# Altium project PowerBoard.PrjPcb
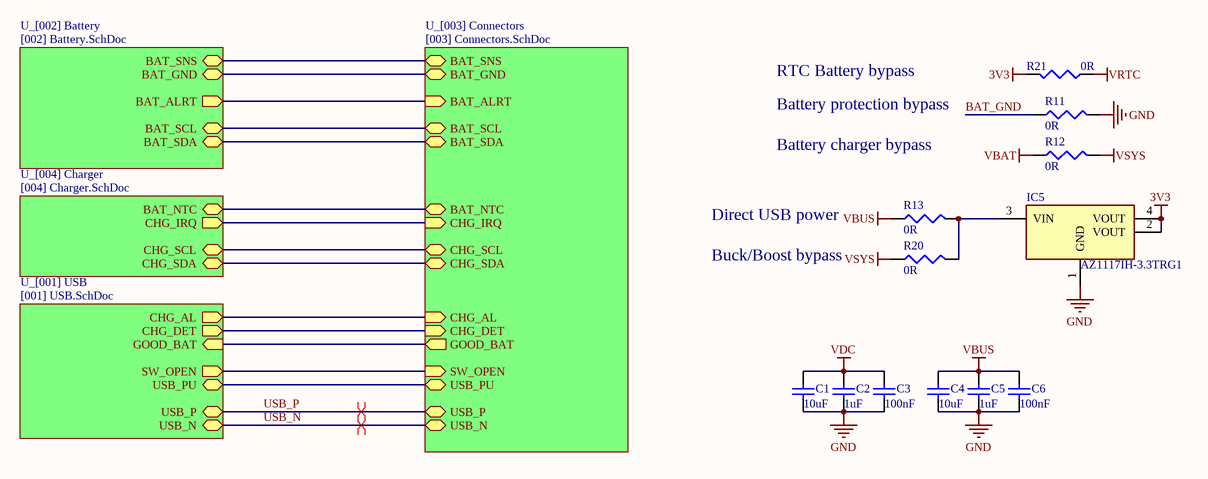
[diagram p0: [000] Block Diagram.SchDoc]
5 sheets, 84 parts. Net scope: global (net labels, ports and power ports of the same name join across sheets).
Board files: PowerBoard.PcbDoc, PowerBoardv2.PcbDoc
Sheets:
  [000] Block Diagram.SchDoc
    U_[004] Charger = [004] Charger.SchDoc
    U_[001] USB = [001] USB.SchDoc
    U_[002] Battery = [002] Battery.SchDoc
    U_[003] Connectors = [003] Connectors.SchDoc

## Sheet [000] Block Diagram.SchDoc
size A4

### Parts
C1  value 10uF  [1608[0603]]  (hidden comment: Cap Semi)
C2  value 1uF  [1608[0603]]  (hidden comment: Cap Semi)
C3  value 100nF  [1608[0603]]  (hidden comment: Cap Semi)
C4  value 10uF  [1608[0603]]  (hidden comment: Cap Semi)
C5  value 1uF  [1608[0603]]  (hidden comment: Cap Semi)
C6  value 100nF  [1608[0603]]  (hidden comment: Cap Semi)
IC5  AZ1117IH-3.3TRG1  [SOT230P700X170-4N]
R11  value 0R  [J1-0603]  (hidden comment: Res3)
R12  value 0R  [J1-0603]  (hidden comment: Res3)
R13  value 0R  [J1-0603]  (hidden comment: Res3)
R20  value 0R  [J1-0603]  (hidden comment: Res3)
R21  value 0R  [J1-0603]  (hidden comment: Res3)

### Sub-sheets
U_[001] USB = [001] USB.SchDoc: USB_N (bidir), USB_P (bidir), USB_PU (bidir), GOOD_BAT (in), SW_OPEN (out), CHG_AL (out), CHG_DET (out)
U_[002] Battery = [002] Battery.SchDoc: BAT_ALRT (out), BAT_SDA (bidir), BAT_SCL (bidir), BAT_GND (bidir), BAT_SNS (bidir)
U_[003] Connectors = [003] Connectors.SchDoc: BAT_SNS (bidir), BAT_GND (bidir), BAT_NTC (bidir), CHG_IRQ (in), BAT_ALRT (in), CHG_SCL (bidir), CHG_SDA (bidir), BAT_SCL (bidir), BAT_SDA (bidir), CHG_AL (in), CHG_DET (in), GOOD_BAT (out), SW_OPEN (in), USB_PU (bidir), USB_P (bidir), USB_N (bidir)
U_[004] Charger = [004] Charger.SchDoc: CHG_IRQ (out), CHG_SDA (bidir), CHG_SCL (bidir), BAT_NTC (bidir)

### Nets
3V3: IC5.2(VOUT) IC5.4(VOUT) R21.2
GND: C1.1 C2.1 C3.1 C4.1 C5.1 C6.1 IC5.1(GND) R11.2
VBAT: R12.1
VBUS: C4.2 C5.2 C6.2 R13.1
VDC: C1.2 C2.2 C3.2
VRTC: R21.1
VSYS: R12.2 R20.1
BAT_GND: R11.1
USB_N: sheet U_[001] USB/USB_N, sheet U_[003] Connectors/USB_N
USB_P: sheet U_[001] USB/USB_P, sheet U_[003] Connectors/USB_P
NetIC5_3: IC5.3(VIN) R13.2 R20.2
(unnamed): sheet U_[004] Charger/CHG_IRQ, sheet U_[003] Connectors/CHG_IRQ
(unnamed): sheet U_[004] Charger/CHG_SDA, sheet U_[003] Connectors/CHG_SDA
(unnamed): sheet U_[004] Charger/CHG_SCL, sheet U_[003] Connectors/CHG_SCL
(unnamed): sheet U_[004] Charger/BAT_NTC, sheet U_[003] Connectors/BAT_NTC
(unnamed): sheet U_[001] USB/USB_PU, sheet U_[003] Connectors/USB_PU
(unnamed): sheet U_[001] USB/GOOD_BAT, sheet U_[003] Connectors/GOOD_BAT
(unnamed): sheet U_[001] USB/SW_OPEN, sheet U_[003] Connectors/SW_OPEN
(unnamed): sheet U_[001] USB/CHG_AL, sheet U_[003] Connectors/CHG_AL
(unnamed): sheet U_[001] USB/CHG_DET, sheet U_[003] Connectors/CHG_DET
(unnamed): sheet U_[002] Battery/BAT_ALRT, sheet U_[003] Connectors/BAT_ALRT
(unnamed): sheet U_[002] Battery/BAT_SDA, sheet U_[003] Connectors/BAT_SDA
(unnamed): sheet U_[002] Battery/BAT_SCL, sheet U_[003] Connectors/BAT_SCL
(unnamed): sheet U_[002] Battery/BAT_GND, sheet U_[003] Connectors/BAT_GND
(unnamed): sheet U_[002] Battery/BAT_SNS, sheet U_[003] Connectors/BAT_SNS

### Layout directives
differential pair: USB_N, USB_P

### Notes on the sheet
- RTC Battery bypass
- Battery protection bypass
- Battery charger bypass
- Direct USB power
- Buck/Boost bypass

### Library data of the parts
C1-C6 = Cap Semi: Capacitor (Semiconductor SIM Model); Published: 8-Jun-2000; LatestRevisionDate: 29-May-2009; LatestRevisionNote: IPC-7351 Footprint Added.; PackageReference: C1206; Publisher: Altium Limited; PackageDescription: Chip Capacitor
IC5 = AZ1117IH-3.3TRG1: Integrated Circuit; Manufacturer_Name: Diodes Inc.; Datasheet Link: https://componentsearchengine.com/Datasheets/1/AZ1117IH-3.3TRG1.pdf; Height: 1.7mm; Mouser2 Part Number: 621-AZ1117IH-3.3TRG1; Mouser2 Price/Stock: https://www.mouser.com/Search/Refine.aspx?Keyword=621-AZ1117IH-3.3TRG1; Manufacturer_Part_Number: AZ1117IH-3.3TRG1
R11-R13 R20 R21 = Res3: Resistor; Published: 8-Jun-2000; LatestRevisionDate: 29-May-2009; LatestRevisionNote: IPC-7351 Footprint Added.; PackageReference: J1-0603; Publisher: Altium Limited; PackageDescription: Chip Resistor

## Sheet [004] Charger.SchDoc
size A4
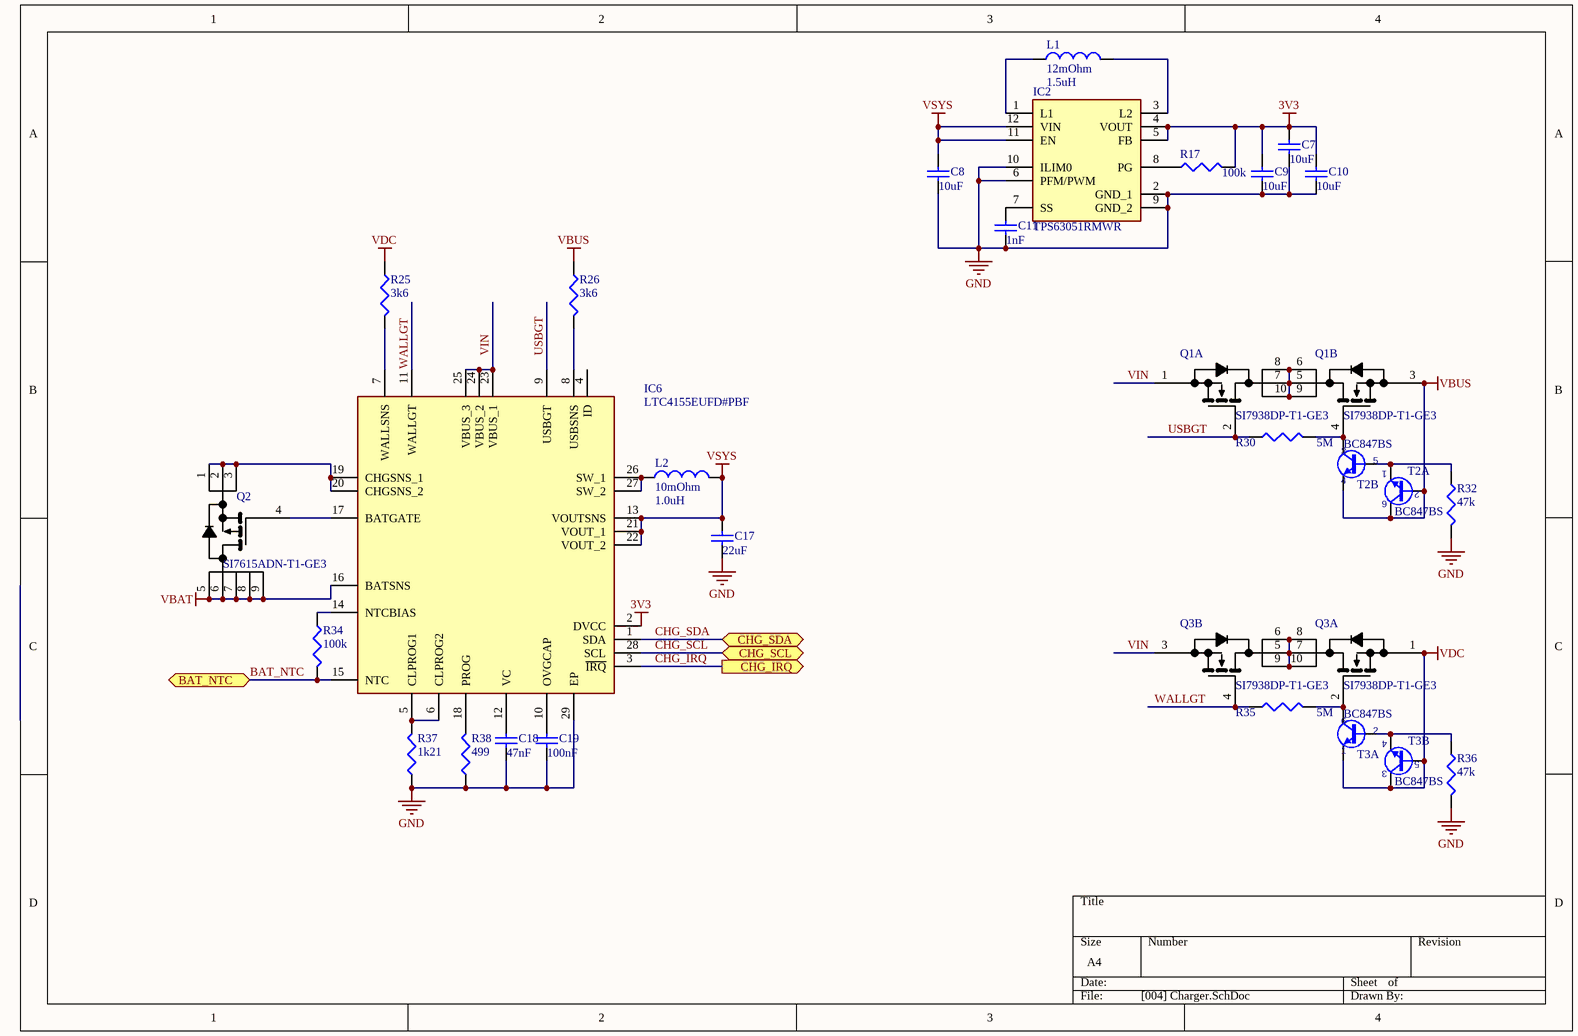
[diagram p1: [004] Charger.SchDoc]

### Parts
C7  value 10uF  [1608[0603]]  (hidden comment: Cap Semi)
C8  value 10uF  [1608[0603]]  (hidden comment: Cap Semi)
C9  value 10uF  [1608[0603]]  (hidden comment: Cap Semi)
C10  value 10uF  [1608[0603]]  (hidden comment: Cap Semi)
C11  value 1nF  [1608[0603]]  (hidden comment: Cap Semi)
C17  value 22uF  [1608[0603]]  (hidden comment: Cap Semi)
C18  value 47nF  [1608[0603]]  (hidden comment: Cap Semi)
C19  value 100nF  [1608[0603]]  (hidden comment: Cap Semi)
IC2  TPS63051RMWR  [QFN50P250X250X100-12N-D]
IC6  LTC4155EUFD#PBF  [QFN50P400X500X80-29N-D]
L1  12mOhm  value 1.5uH  [INDP2523X23N]
L2  10mOhm  value 1.0uH  [INDP2523X23N]
Q1  SI7938DP-T1-GE3  [POWERPAK-SO8_1]  (parts A,B of 2)
Q2  SI7615ADN-T1-GE3  [PowerPAK1212-8 Single]
Q3  SI7938DP-T1-GE3  [POWERPAK-SO8_1]  (parts A,B of 2)
R17  value 100k  [J1-0603]  (hidden comment: Res3)
R25  value 3k6  [J1-0603]  (hidden comment: Res3)
R26  value 3k6  [J1-0603]  (hidden comment: Res3)
R30  value 5M  [J1-0603]  (hidden comment: Res3)
R32  value 47k  [J1-0603]  (hidden comment: Res3)
R34  value 100k  [J1-0603]  (hidden comment: Res3)
R35  value 5M  [J1-0603]  (hidden comment: Res3)
R36  value 47k  [J1-0603]  (hidden comment: Res3)
R37  value 1k21  [J1-0603]  (hidden comment: Res3)
R38  value 499  [J1-0603]  (hidden comment: Res3)
T2  BC847BS  [SOT65P210X110-6N]  (parts A,B of 2)
T3  BC847BS  [SOT65P210X110-6N]  (parts A,B of 2)

### Ports
BAT_NTC (bidir), CHG_IRQ (out), CHG_SCL (bidir), CHG_SDA (bidir)

### Nets
3V3: C7.2 C9.2 C10.2 IC2.4(VOUT) IC2.5(FB) IC6.2(DVCC) R17.2
GND: C7.1 C8.1 C9.1 C10.1 C11.1 C17.1 C18.1 C19.1 IC2.2(GND_1) IC2.6(PFM/PWM) IC2.9(GND_2) IC2.10(ILIM0) IC6.29(EP) R32.2 R36.2 R37.1 R38.1
VBAT: IC6.16(BATSNS) Q2.5(D) Q2.6(D) Q2.7(D) Q2.8(D) Q2.9(D)
VBUS: Q1.3(S2) R26.1 T2.2(B) T2.4(E) T2.6(C)
VDC: Q3.1(S1) R25.1 T3.1(E) T3.3(C) T3.5(B)
VSYS: C8.2 C17.2 IC2.11(EN) IC2.12(VIN) IC6.13(VOUTSNS) IC6.21(VOUT_1) IC6.22(VOUT_2) L2.2
BAT_NTC: IC6.15(NTC) R34.2 ; port BAT_NTC
CHG_IRQ: IC6.3(~{IRQ}) ; port CHG_IRQ
CHG_SCL: IC6.28(SCL) ; port CHG_SCL
CHG_SDA: IC6.1(SDA) ; port CHG_SDA
USBGT: IC6.9(USBGT) Q1.2(G1) R30.1
VIN: IC6.23(VBUS_1) IC6.24(VBUS_2) IC6.25(VBUS_3) Q1.1(S1) Q3.3(S2)
WALLGT: IC6.11(WALLGT) Q3.4(G2) R35.1
NetC11_2: C11.2 IC2.7(SS)
NetC18_2: C18.2 IC6.12(VC)
NetC19_2: C19.2 IC6.10(OVGCAP)
NetIC2_1: IC2.1(L1) L1.1
NetIC2_3: IC2.3(L2) L1.2
NetIC2_8: IC2.8(PG) R17.1
NetIC6_5: IC6.5(CLPROG1) IC6.6(CLPROG2) R37.2
NetIC6_7: IC6.7(WALLSNS) R25.2
NetIC6_8: IC6.8(USBSNS) R26.2
NetIC6_14: IC6.14(NTCBIAS) R34.1
NetIC6_17: IC6.17(BATGATE) Q2.4(G)
NetIC6_18: IC6.18(PROG) R38.2
NetIC6_19: IC6.19(CHGSNS_1) IC6.20(CHGSNS_2) Q2.1(S) Q2.2(S) Q2.3(S)
NetIC6_26: IC6.26(SW_1) IC6.27(SW_2) L2.1
NetQ1_4: Q1.4(G2) R30.2 T2.3(C)
NetQ1_5: Q1.5(D2_1) Q1.6(D2_2) Q1.7(D1_1) Q1.8(D1_2) Q1.9(D2_3) Q1.10(D1_3)
NetQ3_2: Q3.2(G1) R35.2 T3.6(C)
NetQ3_5: Q3.5(D2_1) Q3.6(D2_2) Q3.7(D1_1) Q3.8(D1_2) Q3.9(D2_3) Q3.10(D1_3)
NetR32_1: R32.1 T2.1(E) T2.5(B)
NetR36_1: R36.1 T3.2(B) T3.4(E)

Not connected (* = marked no-connect by the designer): IC6 4(ID)

### Library data of the parts
C7-C11 C17-C19 = Cap Semi: Capacitor (Semiconductor SIM Model); Published: 8-Jun-2000; LatestRevisionDate: 29-May-2009; LatestRevisionNote: IPC-7351 Footprint Added.; PackageReference: C1206; Publisher: Altium Limited; PackageDescription: Chip Capacitor
IC2 = TPS63051RMWR: Integrated Circuit; Manufacturer_Name: Texas Instruments; Datasheet Link: http://www.ti.com/lit/gpn/tps63051; Height: 1mm; Manufacturer_Part_Number: TPS63051RMWR; ComponentLink1Description: TPS6305x Datasheet; ComponentLink1URL: http://www.ti.com/lit/ds/symlink/tps63051.pdf
IC6 = LTC4155EUFD#PBF: Integrated Circuit; Manufacturer_Name: Linear Technology; Datasheet Link: http://www.analog.com/media/en/technical-documentation/data-sheets/4155fd.pdf; Height: 0.8mm; Manufacturer_Part_Number: LTC4155EUFD#PBF
L1 = Inductor: Inductor SRN6045TA-1R5Y; Code_IEC: 1005; Published: 8-Jun-2000; LatestRevisionDate: 29-May-2009; LatestRevisionNote: IPC-7351 Footprint Added.; PackageReference: 0402-A; Publisher: Altium Limited; PackageDescription: Chip Inductor; Code_JEITA: 0402; ComponentLink1Description: SRN6045TA-1R5Y (Mouser); ComponentLink1URL: https://pl.mouser.com/ProductDetail/Bourns/SRN6045TA-1R5Y?qs=sGAEpiMZZMsg%252By3WlYCkU3tyM9HcjVri8VL%2FIY%252BgGEQ%3D
L2 = Inductor: Inductor SRN6045TA-1R0Y; Code_IEC: 1005; Published: 8-Jun-2000; LatestRevisionDate: 29-May-2009; LatestRevisionNote: IPC-7351 Footprint Added.; PackageReference: 0402-A; Publisher: Altium Limited; PackageDescription: Chip Inductor; Code_JEITA: 0402; ComponentLink2Description: SRN6045-1R0Y (Mouser); ComponentLink2URL: pl.mouser.com/ProductDetail/Bourns/SRN6045-1R0Y?qs=sGAEpiMZZMsg%252By3WlYCkU0o4wAoqWTm0KET%2FFU%252BpntA%3D
Q1 Q3 = SI7938DP-T1-GE3: MOSFET (N-Channel); Manufacturer_Name: Vishay; Datasheet Link: https://www.vishay.com/docs/65365/si7938dp.pdf; Manufacturer_Part_Number: SI7938DP-T1-GE3
Q2 = SI7615ADN-T1-GE3: MOSFET (P-Channel); Manufacturer_Name: Vishay; Manufacturer_Part_Number: SIS413DN-T1-GE3; ComponentLink1Description: Mouser; ComponentLink1URL: https://pl.mouser.com/ProductDetail/Vishay-Siliconix/SI7615ADN-T1-GE3?qs=sGAEpiMZZMshyDBzk1%2FWi6E1PdrpaYNpUmwK%2FZj1bgw%3D; ComponentLink2Description: Datasheet; ComponentLink2URL: https://pl.mouser.com/datasheet/2/427/si7615cdn-1018932.pdf
R17 R25 R26 R30 R32 R34-R38 = Res3: Resistor; Published: 8-Jun-2000; LatestRevisionDate: 29-May-2009; LatestRevisionNote: IPC-7351 Footprint Added.; PackageReference: J1-0603; Publisher: Altium Limited; PackageDescription: Chip Resistor
T2 T3 = BC847BS: 45V 100mA Dual NPN General-Purpose Transistor; Manufacturer: NXP SEMICONDUCTORS; PressFit: No; Bonding: No; Part Number: BC847BS; Component Kind: Standard; Component Type: Standard; Device: BC847BS; PackageDescription: SOT363, SC-88, SOT, 0.65mm Pitch, 6 pin, 1.25mm W X 2.00mm L X 1.10mm H, IPC Medium Density; Part Description: 45V 100mA Dual NPN General-Purpose Transistor; Manufacturer Part Number: BC847BS; Pin Count: 6; Case: SOT363; Mounted: Yes; Socket: No; SMD: Yes; Sense: No; ComponentHeight: 1.1mm; HelpURL: \\cern.ch\dfs\Applications\Altium\Datasheets\BC847BS.pdf; Author: CERN DEM JMW; CreateDate: 10.07.2015; LatestRevisionDate: 10.07.2015

## Sheet [001] USB.SchDoc
size A4
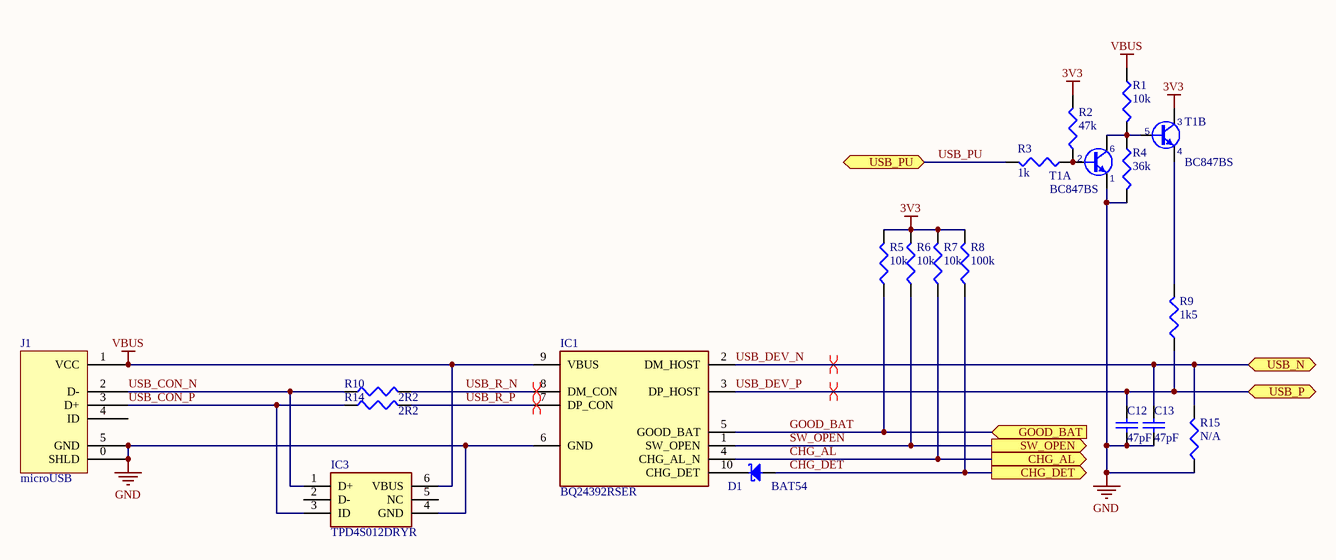
[diagram p2: [001] USB.SchDoc]

### Parts
C12  value 47pF  [1608[0603]]  (hidden comment: Cap Semi)
C13  value 47pF  [1608[0603]]  (hidden comment: Cap Semi)
D1  BAT54  [SOT95P240X130-3N]
IC1  BQ24392RSER  [RSE(R-PUQFN-N10)]
IC3  TPD4S012DRYR  [SON50P100X145X60-6N]
J1  microUSB  [UB-MC5BR3-SDWP604-4S - custom]
R1  value 10k  [J1-0603]  (hidden comment: Res3)
R2  value 47k  [J1-0603]  (hidden comment: Res3)
R3  value 1k  [J1-0603]  (hidden comment: Res3)
R4  value 36k  [J1-0603]  (hidden comment: Res3)
R5  value 10k  [J1-0603]  (hidden comment: Res3)
R6  value 10k  [J1-0603]  (hidden comment: Res3)
R7  value 10k  [J1-0603]  (hidden comment: Res3)
R8  value 100k  [J1-0603]  (hidden comment: Res3)
R9  value 1k5  [J1-0603]  (hidden comment: Res3)
R10  value 2R2  [J1-0603]  (hidden comment: Res3)
R14  value 2R2  [J1-0603]  (hidden comment: Res3)
R15  Res3  [J1-0603]  (value not drawn)
T1  BC847BS  [SOT65P210X110-6N]  (parts A,B of 2)

### Ports
CHG_AL (out), CHG_DET (out), GOOD_BAT (in), SW_OPEN (out), USB_N (bidir), USB_P (bidir), USB_PU (bidir)

### Nets
3V3: R2.2 R5.2 R6.2 R7.2 R8.2 T1.3(C)
GND: C12.2 C13.2 IC1.6(GND) IC3.4(GND) J1.0(SHLD) J1.5(GND) R4.2 R15.1 T1.1(E)
VBUS: IC1.9(VBUS) IC3.6(VBUS) J1.1(VCC) R1.1
CHG_AL: IC1.4(CHG_AL_N) R7.1 ; port CHG_AL
CHG_DET: D1.1(A) R8.1 ; port CHG_DET
GOOD_BAT: IC1.5(GOOD_BAT) R5.1 ; port GOOD_BAT
SW_OPEN: IC1.1(SW_OPEN) R6.1 ; port SW_OPEN
USB_CON_N: IC3.1(D+) J1.2(D-) R10.1
USB_CON_P: IC3.3(ID) J1.3(D+) R14.1
USB_DEV_N: C13.1 IC1.2(DM_HOST) R15.2 ; port USB_N
USB_DEV_P: C12.1 IC1.3(DP_HOST) R9.1 ; port USB_P
USB_PU: R3.2 ; port USB_PU
USB_R_N: IC1.8(DM_CON) R10.2
USB_R_P: IC1.7(DP_CON) R14.2
NetD1_3: D1.3(C) IC1.10(CHG_DET)
NetR1_2: R1.2 R4.1 T1.5(B) T1.6(C)
NetR2_1: R2.1 R3.1 T1.2(B)
NetR9_2: R9.2 T1.4(E)

Not connected (* = marked no-connect by the designer): IC3 2(D-) 5(NC); J1 4(ID)

### Layout directives
differential pair: USB_DEV_N, USB_DEV_P, USB_R_N, USB_R_P

### Library data of the parts
C12 C13 = Cap Semi: Capacitor (Semiconductor SIM Model); Published: 8-Jun-2000; LatestRevisionDate: 29-May-2009; LatestRevisionNote: IPC-7351 Footprint Added.; PackageReference: C1206; Publisher: Altium Limited; PackageDescription: Chip Capacitor
D1 = BAT54: Diode Schottky  Anode Pin 1 Cathode Pin 3 (Pas de pin 2); Part Description: Single Small Signal Schottky Diode; Manufacturer: FAIRCHILD SEMICONDUCTOR; Voltage: 30V; Power: 200mA; PressFit: No; Bonding: No; Part Number: BAT54; Component Kind: Standard; Component Type: Standard; Device: BAT54; PackageDescription: SOT23 3-Leads, Pitch 0.95mm - Body 1.3x2.9mm, IPC Medium Density; Manufacturer Part Number: BAT54; Pin Count: 3; Case: SOT23-3; Mounted: Yes; Socket: No; SMD: Yes; Sense: No; ComponentHeight: 1.30mm; HelpURL: \\cern.ch\dfs\Applications\Altium\Datasheets\BAT54.pdf; Author: CERN DEM JLC; CreateDate: 17.09.2009; LatestRevisionDate: 27.05.2010
IC1 = BQ24392RSER: Integrated Circuit; Manufacturer_Name: Texas Instruments; Datasheet Link: http://www.ti.com/lit/gpn/bq24392; Manufacturer_Part_Number: BQ24392RSER; Mouser Part Number: 595-BQ24392RSER; Mouser Price/Stock: https://www.mouser.com/Search/Refine.aspx?Keyword=595-BQ24392RSER; RS Part Number: 8279327; RS Price/Stock: http://uk.rs-online.com/web/p/products/8279327
IC3 = TPD4S012DRYR: Integrated Circuit; Manufacturer_Name: Texas Instruments; Datasheet Link: http://www.ti.com/lit/ds/symlink/tpd4s012.pdf; Height: 0.6mm; Mouser2 Part Number: 595-TPD4S012DRYR; Mouser2 Price/Stock: https://www.mouser.com/Search/Refine.aspx?Keyword=595-TPD4S012DRYR; Manufacturer_Part_Number: TPD4S012DRYR
J1 = microUSB: microUSB connector
R1-R10 R14 R15 = Res3: Resistor; Published: 8-Jun-2000; LatestRevisionDate: 29-May-2009; LatestRevisionNote: IPC-7351 Footprint Added.; PackageReference: J1-0603; Publisher: Altium Limited; PackageDescription: Chip Resistor
  R15: Value: N/A
T1 = BC847BS: as T2 on sheet [004] Charger; Part Number: BC847BS; Component Kind: Standard; Component Type: Standard; Device: BC847BS; PackageDescription: SOT363, SC-88, SOT, 0.65mm Pitch, 6 pin, 1.25mm W X 2.00mm L X 1.10mm H, IPC Medium Density; Part Description: 45V 100mA Dual NPN General-Purpose Transistor; Manufacturer Part Number: BC847BS; Pin Count: 6; Case: SOT363; Mounted: Yes; Socket: No; SMD: Yes; Sense: No; ComponentHeight: 1.1mm; HelpURL: \\cern.ch\dfs\Applications\Altium\Datasheets\BC847BS.pdf; Author: CERN DEM JMW; CreateDate: 10.07.2015; LatestRevisionDate: 10.07.2015

## Sheet [002] Battery.SchDoc
size A4
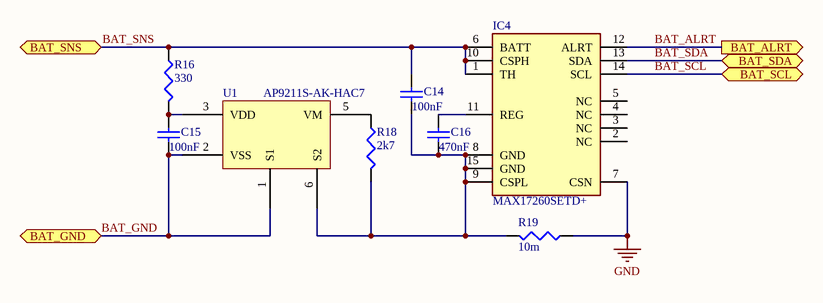
[diagram p3: [002] Battery.SchDoc]

### Parts
C14  value 100nF  [1608[0603]]  (hidden comment: Cap Semi)
C15  value 100nF  [1608[0603]]  (hidden comment: Cap Semi)
C16  value 470nF  [1608[0603]]  (hidden comment: Cap Semi)
IC4  MAX17260SETD+  [SON40P300X300X80-15N]
R16  value 330  [J1-0603]  (hidden comment: Res3)
R18  value 2k7  [J1-0603]  (hidden comment: Res3)
R19  value 10m  [RESC3216X80N]  (hidden comment: Res3)
U1  AP9211S-AK-HAC7  [U-DFN2030-6]

### Ports
BAT_ALRT (out), BAT_GND (bidir), BAT_SCL (bidir), BAT_SDA (bidir), BAT_SNS (bidir)

### Nets
GND: IC4.7(CSN) R19.1
BAT_ALRT: IC4.12(ALRT) ; port BAT_ALRT
BAT_GND: C15.1 U1.1(S1) U1.2(VSS) ; port BAT_GND
BAT_SCL: IC4.14(SCL) ; port BAT_SCL
BAT_SDA: IC4.13(SDA) ; port BAT_SDA
BAT_SNS: C14.2 IC4.1(TH) IC4.6(BATT) IC4.10(CSPH) R16.1 ; port BAT_SNS
NetC14_1: C14.1 C16.1 IC4.8(GND) IC4.9(CSPL) IC4.15(GND) R18.2 R19.2 U1.6(S2)
NetC15_2: C15.2 R16.2 U1.3(VDD)
NetC16_2: C16.2 IC4.11(REG)
NetR18_1: R18.1 U1.5(VM)

Not connected (* = marked no-connect by the designer): IC4 2(NC) 3(NC) 4(NC) 5(NC)

### Library data of the parts
C14-C16 = Cap Semi: Capacitor (Semiconductor SIM Model); Published: 8-Jun-2000; LatestRevisionDate: 29-May-2009; LatestRevisionNote: IPC-7351 Footprint Added.; PackageReference: C1206; Publisher: Altium Limited; PackageDescription: Chip Capacitor
IC4 = MAX17260SETD+: Integrated Circuit; Manufacturer_Name: Maxim Integrated; Datasheet Link: https://componentsearchengine.com/Datasheets/1/MAX17260SETD+.pdf; Height: 0.8mm; Mouser2 Part Number: 700-MAX17260SETD+; Mouser2 Price/Stock: https://www.mouser.com/Search/Refine.aspx?Keyword=700-MAX17260SETD%2B; Manufacturer_Part_Number: MAX17260SETD+; ComponentLink1Description: MAX17260 Datasheet; ComponentLink1URL: https://datasheets.maximintegrated.com/en/ds/MAX17260.pdf; ComponentLink2Description: MAX17260SETD+ (Mouser); ComponentLink2URL: https://pl.mouser.com/ProductDetail/Maxim-Integrated/MAX17260SETD%2b?qs=sGAEpiMZZMve4%2FbfQkoj%252BAnnYqGcWj2a8PZHpMVmFSA%3D; ComponentLink3Description: MAX17260 User Guide; ComponentLink3URL: https://pdfserv.maximintegrated.com/en/an/MAX1726x-ModelGauge-m5-EZ-user-guide.pdf
R16 R18 R19 = Res3: Resistor; Published: 8-Jun-2000; LatestRevisionDate: 29-May-2009; LatestRevisionNote: IPC-7351 Footprint Added.; PackageReference: J1-0603; Publisher: Altium Limited; PackageDescription: Chip Resistor
U1 = AP9211: SINGLE CHIP SOLUTION FOR 1-CELL Li+ BATTERY PACK; ComponentLink1Description: AP9211S-AK-HAC-7 (Mouser); ComponentLink1URL: https://pl.mouser.com/ProductDetail/Diodes-Incorporated/AP9211S-AK-HAC-7?qs=%2Fha2pyFaduhU8ORG8s%252BdQ8ce%2FFXbiZtTJujjlGEM9Y4G1qKWx8axSg%3D%3D; ComponentLink2Description: AP9211 Datasheet; ComponentLink2URL: https://www.diodes.com/assets/Datasheets/AP9211.pdf

## Sheet [003] Connectors.SchDoc
size A4
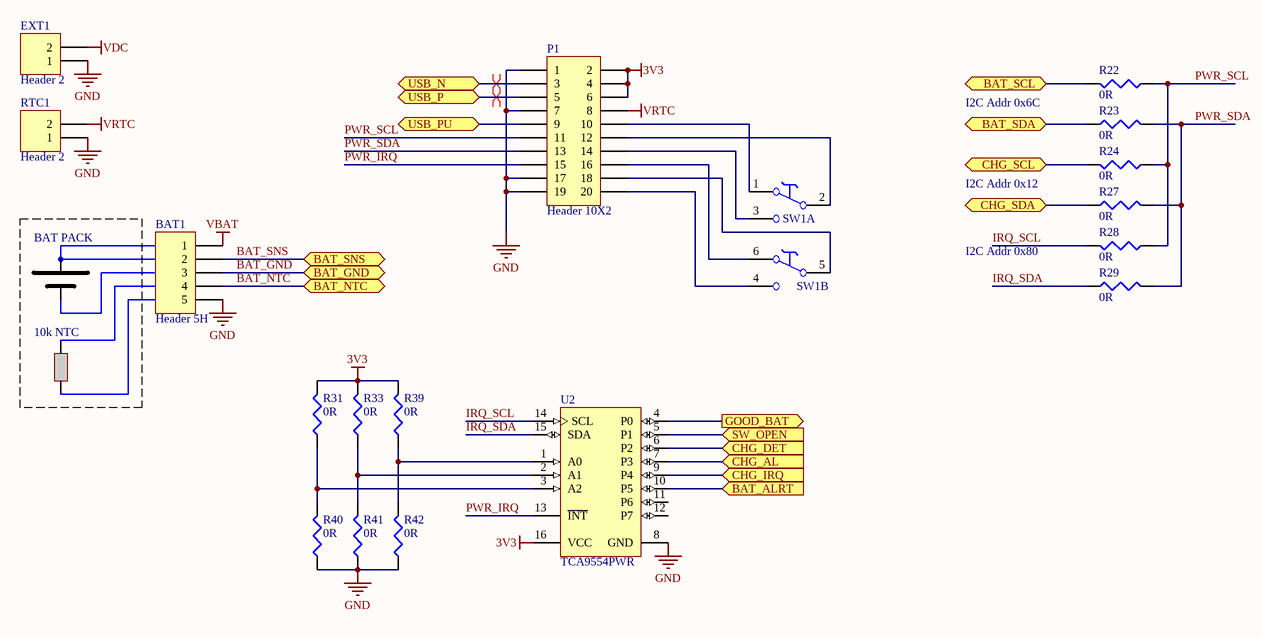
[diagram p4: [003] Connectors.SchDoc]

### Parts
BAT1  Header 5H  [MOLEX-705530004]
EXT1  Header 2  [MOLEX-705530001]
P1  Header 10X2  [SAMTEC_TSW-110-07-L-D-LL]
R22  value 0R  [J1-0603]  (hidden comment: Res3)
R23  value 0R  [J1-0603]  (hidden comment: Res3)
R24  value 0R  [J1-0603]  (hidden comment: Res3)
R27  value 0R  [J1-0603]  (hidden comment: Res3)
R28  value 0R  [J1-0603]  (hidden comment: Res3)
R29  value 0R  [J1-0603]  (hidden comment: Res3)
R31  value 0R  [J1-0603]  (hidden comment: Res3)
R33  value 0R  [J1-0603]  (hidden comment: Res3)
R39  value 0R  [J1-0603]  (hidden comment: Res3)
R40  value 0R  [J1-0603]  (hidden comment: Res3)
R41  value 0R  [J1-0603]  (hidden comment: Res3)
R42  value 0R  [J1-0603]  (hidden comment: Res3)
RTC1  Header 2  [MOLEX-705530001]
SW1  Switch  [EG2215]  (value not drawn)  (parts A,B of 2)
U2  TCA9554PWR  [PW16_N]

### Ports
BAT_ALRT (in), BAT_GND (bidir), BAT_NTC (bidir), BAT_SCL (bidir), BAT_SDA (bidir), BAT_SNS (bidir), CHG_AL (in), CHG_DET (in), CHG_IRQ (in), CHG_SCL (bidir), CHG_SDA (bidir), GOOD_BAT (out), SW_OPEN (in), USB_N (bidir), USB_P (bidir), USB_PU (bidir)

### Nets
3V3: P1.2 P1.4 P1.6 R31.2 R33.2 R39.2 U2.16(VCC)
GND: BAT1.5 EXT1.1 P1.1 P1.7 P1.17 P1.19 R40.1 R41.1 R42.1 RTC1.1 U2.8(GND)
VBAT: BAT1.1
VDC: EXT1.2
VRTC: P1.8 RTC1.2
BAT_ALRT: U2.10(P5) ; port BAT_ALRT
BAT_GND: BAT1.3 ; port BAT_GND
BAT_NTC: BAT1.4 ; port BAT_NTC
BAT_SCL: R22.2 ; port BAT_SCL
BAT_SDA: R23.1 ; port BAT_SDA
BAT_SNS: BAT1.2 ; port BAT_SNS
CHG_AL: U2.7(P3) ; port CHG_AL
CHG_DET: U2.6(P2) ; port CHG_DET
CHG_IRQ: U2.9(P4) ; port CHG_IRQ
CHG_SCL: R24.2 ; port CHG_SCL
CHG_SDA: R27.1 ; port CHG_SDA
GOOD_BAT: U2.4(P0) ; port GOOD_BAT
IRQ_SCL: R28.2 U2.14(SCL)
IRQ_SDA: R29.1 U2.15(SDA)
PWR_IRQ: P1.15 U2.13(~{INT})
PWR_SCL: P1.11 R22.1 R24.1 R28.1
PWR_SDA: P1.13 R23.2 R27.2 R29.2
SW_OPEN: U2.5(P1) ; port SW_OPEN
USB_DEV_N: P1.3 ; port USB_N
USB_DEV_P: P1.5 ; port USB_P
USB_PU: P1.9 ; port USB_PU
NetP1_10: P1.10 SW1.1
NetP1_12: P1.12 SW1.2
NetP1_14: P1.14 SW1.3
NetP1_16: P1.16 SW1.6
NetP1_18: P1.18 SW1.5
NetP1_20: P1.20 SW1.4
NetR31_1: R31.1 R40.2 U2.3(A2)
NetR33_1: R33.1 R41.2 U2.2(A1)
NetR39_1: R39.1 R42.2 U2.1(A0)

Not connected (* = marked no-connect by the designer): U2 11(P6) 12(P7)

### Layout directives
differential pair: USB_DEV_N, USB_DEV_P

### Notes on the sheet
- I2C Addr 0x6C
- BAT PACK
- I2C Addr 0x12
- I2C Addr 0x80
- 10k NTC

### Library data of the parts
BAT1 = Header 5H: Header, 5-Pin, Right Angle; LatestRevisionDate: 17-Jul-2002; LatestRevisionNote: Re-released for DXP Platform.; Publisher: Altium Limited
EXT1 RTC1 = Header 2: Header, 2-Pin; LatestRevisionDate: 17-Jul-2002; LatestRevisionNote: Re-released for DXP Platform.; Publisher: Altium Limited
P1 = Header 10X2: Header, 10-Pin, Dual row; LatestRevisionDate: 17-Jul-2002; LatestRevisionNote: Re-released for DXP Platform.; Publisher: Altium Limited
R22-R24 R27-R29 R31 R33 R39-R42 = Res3: Resistor; Published: 8-Jun-2000; LatestRevisionDate: 29-May-2009; LatestRevisionNote: IPC-7351 Footprint Added.; PackageReference: J1-0603; Publisher: Altium Limited; PackageDescription: Chip Resistor
SW1 = SW_TYCO_1825010-5: DPDTSwitch; Part Description: Surface Mount DPDT Slide DIP Switch, Extented Top Actuator, Contact Rating 300mA @ 115VDC; Manufacturer: TYCO; Manufacturer Part Number: 1825010-5 or ASE22GL04; PressFit: No; Part Number: SW_TYCO_1825010-5; Component Kind: Standard; Component Type: Standard; Footprint: SW_TYCO_1825010-5; Pin Count: 6; PackageDescription: Pitch 2.54mm,  Body 10.16x7.36mm, DPDT  SMD Slide DIP Switch, Extented Top Actuator, TYCO ASE/F Series; Family: Switch; Mounted: Yes; Socket: No; SMD: Yes; Sense: No; Status: None; ComponentHeight: 8.14mm; HelpURL: \\cern.ch\dfs\Applications\Altium\Datasheets\SW_TYCO_1825010-5.pdf; Author: CERN DEM JLC; CreateDate: 26.02.2015; LatestRevisionDate: 26.02.2015
U2 = TCA9554PWR: Remote 8-Bit I2C and SMBus I/O Expander, 1.65 to 5.5 V, -40 to 85 degC, 16-pin TSSOP (PW), Green (RoHS & no Sb/Br); Manufacturer: Texas Instruments; SubFamily: I2C IO Expander; Interrupt Output: Yes; fSCLK(Max)(MHz): 401; VCC(Min)(V): 1.65; VCC(Max)(V): 5.5; Max Frequency(kHz): 400; I2C Address: 0100xxx; # of I/Os: 8; DatasheetVersion: SCPS233; PackageVersion: revG, Feb-2011; PackageReference: PW16; PackageDescription: 16-Pin Plastic Thin Small Outline Package 5 x 4.4 mm Body ,0.65 mm Pitch; Supplier 1: Digi-Key; Supplier Part Number 1: 296-30135-2-ND; Supplier 2: Digi-Key; Supplier Part Number 2: 296-30135-1-ND; Supplier 3: Digi-Key; Supplier Part Number 3: 296-30135-6-ND; Supplier 4: Newark; Supplier Part Number 4: 76T8038; Supplier 5: Mouser; Supplier Part Number 5: 595-TCA9554PWR; Eco-Plan: Green (RoHS & no Sb/Br); Vcc range(V): 1.65 to 5.5; Low Power: Yes; Configuration Registers: Yes; 5V Tolerant I/O: Yes; Mounting Technology: Surface Mount; PartNumber: TCA9554PWR; Code_JEDEC: MO-153; ComponentLink1Description: Datasheet; ComponentLink1URL: http://www.ti.com/general/docs/lit/getliterature.tsp?genericPartNumber=TCA9554&fileType=pdf

## Nets that join several sheets
3V3: [000] Block Diagram (IC5.2 IC5.4 R21.2), [004] Charger (7 pins), [001] USB (6 pins), [003] Connectors (7 pins)
GND: [000] Block Diagram (8 pins), [004] Charger (17 pins), [001] USB (9 pins), [002] Battery (IC4.7 R19.1), [003] Connectors (11 pins)
VBAT: [000] Block Diagram (R12.1), [004] Charger (6 pins), [003] Connectors (BAT1.1)
VBUS: [000] Block Diagram (C4.2 C5.2 C6.2 R13.1), [004] Charger (5 pins), [001] USB (IC1.9 IC3.6 J1.1 R1.1)
VDC: [000] Block Diagram (C1.2 C2.2 C3.2), [004] Charger (5 pins), [003] Connectors (EXT1.2)
VRTC: [000] Block Diagram (R21.1), [003] Connectors (P1.8 RTC1.2)
VSYS: [000] Block Diagram (R12.2 R20.1), [004] Charger (8 pins)
BAT_ALRT: [002] Battery (IC4.12), [003] Connectors (U2.10)
BAT_GND: [000] Block Diagram (R11.1), [002] Battery (C15.1 U1.1 U1.2), [003] Connectors (BAT1.3)
BAT_NTC: [004] Charger (IC6.15 R34.2), [003] Connectors (BAT1.4)
BAT_SCL: [002] Battery (IC4.14), [003] Connectors (R22.2)
BAT_SDA: [002] Battery (IC4.13), [003] Connectors (R23.1)
BAT_SNS: [002] Battery (5 pins), [003] Connectors (BAT1.2)
CHG_AL: [001] USB (IC1.4 R7.1), [003] Connectors (U2.7)
CHG_DET: [001] USB (D1.1 R8.1), [003] Connectors (U2.6)
CHG_IRQ: [004] Charger (IC6.3), [003] Connectors (U2.9)
CHG_SCL: [004] Charger (IC6.28), [003] Connectors (R24.2)
CHG_SDA: [004] Charger (IC6.1), [003] Connectors (R27.1)
GOOD_BAT: [001] USB (IC1.5 R5.1), [003] Connectors (U2.4)
SW_OPEN: [001] USB (IC1.1 R6.1), [003] Connectors (U2.5)
USB_DEV_N: [001] USB (C13.1 IC1.2 R15.2), [003] Connectors (P1.3)
USB_DEV_P: [001] USB (C12.1 IC1.3 R9.1), [003] Connectors (P1.5)
USB_PU: [001] USB (R3.2), [003] Connectors (P1.9)